# EasyEDA Pro project Magmattic PCB_V2.eprj, schematic BB-ADS1262-Rev.A
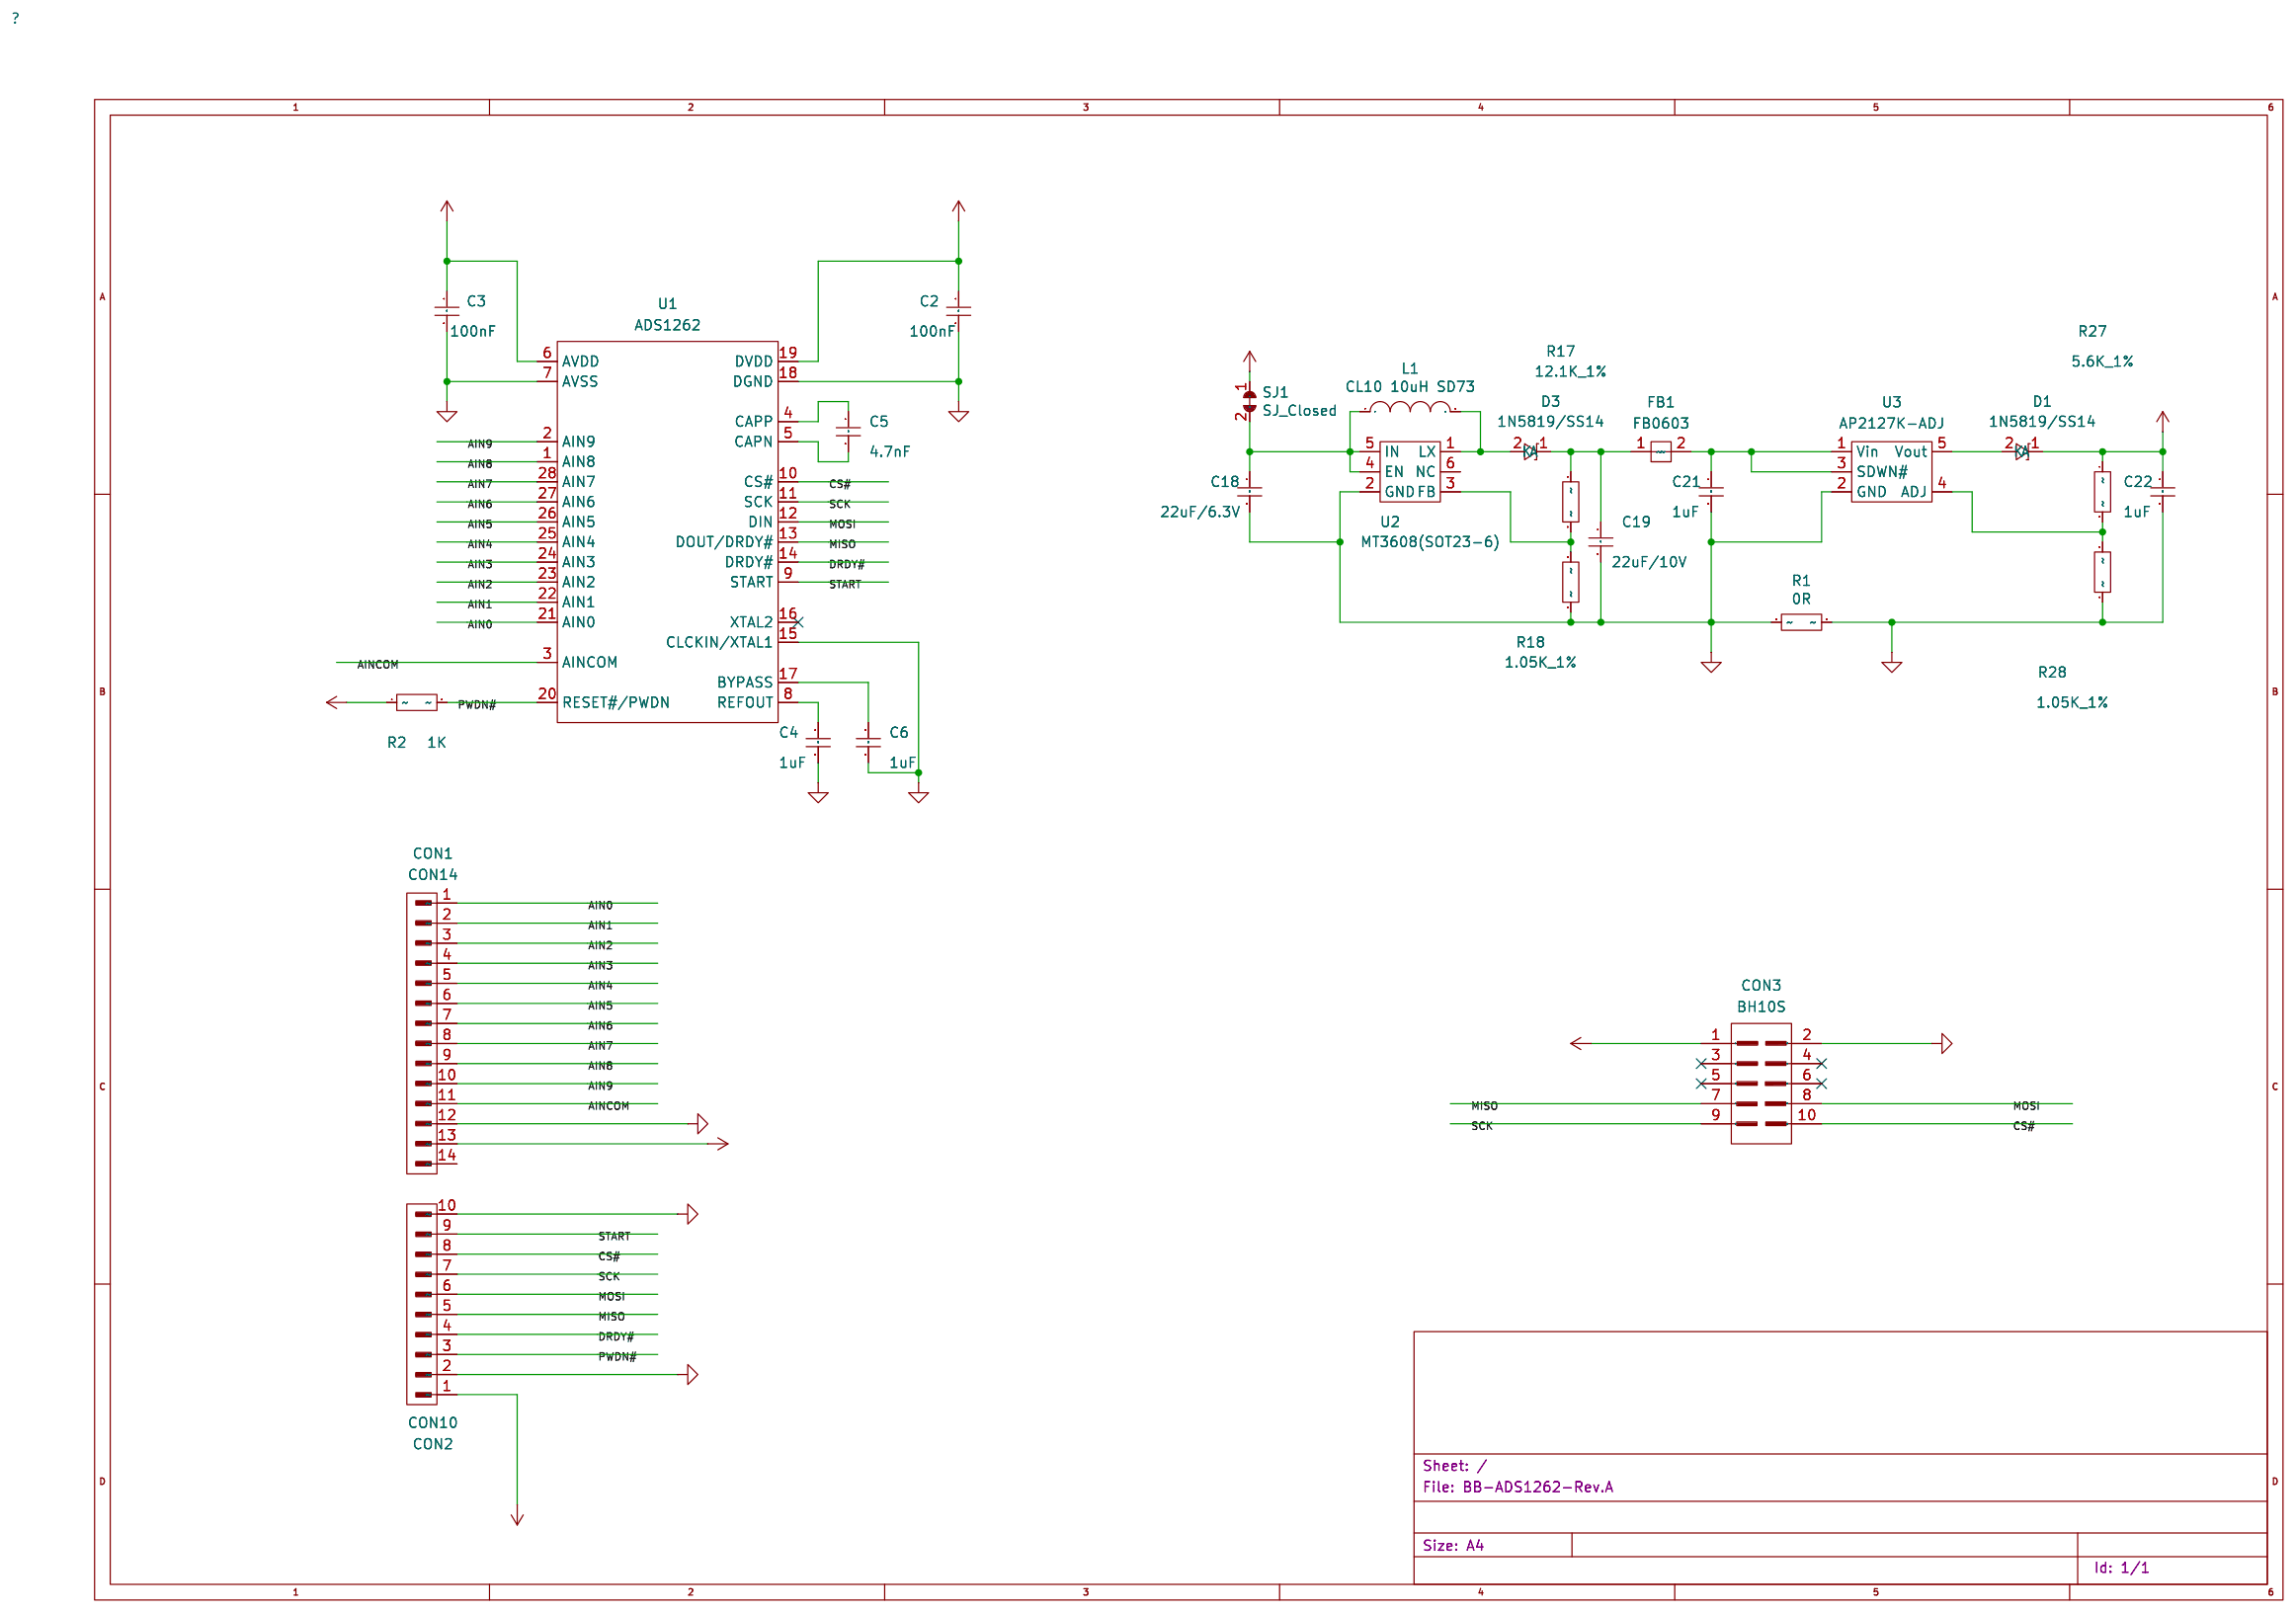
[diagram p1: schematic sheet]

## Parts
C2  100nF  [OLIMEX_RLC-FP:C_0603_5MIL_DWS]
C3  100nF  [OLIMEX_RLC-FP:C_0603_5MIL_DWS]
C4  1uF  [OLIMEX_RLC-FP:C_0603_5MIL_DWS]
C5  4.7nF  [OLIMEX_RLC-FP:C_0603_5MIL_DWS]
C6  1uF  [OLIMEX_RLC-FP:C_0603_5MIL_DWS]
C18  22uF/6.3V  [OLIMEX_RLC-FP:C_0603_5MIL_DWS]
C19  22uF/10V  [OLIMEX_RLC-FP:C_0603_5MIL_DWS]
C21  1uF  [OLIMEX_RLC-FP:C_0603_5MIL_DWS]
C22  1uF  [OLIMEX_RLC-FP:C_0603_5MIL_DWS]
CON1  CON14  [OLIMEX_Connectors-FP:HN1x13]
CON2  CON10  [OLIMEX_Connectors-FP:HN1x10]
CON3  BH10S  [OLIMEX_Connectors-FP:UEXTF]
D1  1N5819/SS14  [OLIMEX_Diodes-FP:SOD-123_KA]
D3  1N5819/SS14  [OLIMEX_Diodes-FP:SOD-123_KA]
FB1  FB0603  [OLIMEX_RLC-FP:L_0603_5MIL_DWS]
L1  CL10 10uH SD73  [OLIMEX_RLC-FP:SD73]
R1  0R  [OLIMEX_RLC-FP:R_0603_5MIL_0R(Board_Mounted)]
R2  1K  [OLIMEX_RLC-FP:R_0603_5MIL_DWS]
R17  12.1K_1%  [OLIMEX_RLC-FP:R_0603_5MIL_DWS]
R18  1.05K_1%  [OLIMEX_RLC-FP:R_0603_5MIL_DWS]
R27  5.6K_1%  [OLIMEX_RLC-FP:R_0603_5MIL_DWS]
R28  1.05K_1%  [OLIMEX_RLC-FP:R_0603_5MIL_DWS]
SJ1  SJ_Closed
U1  ADS1262  [OLIMEX_IC-FP:TSSOP28-PW]
U2  MT3608(SOT23-6)  [OLIMEX_Regulators-FP:SOT23-6]
U3  AP2127K-ADJ  [OLIMEX_Regulators-FP:SOT-23-5]

## Library data of the parts
C2-C6 C18 C19 C21 C22 = BB-ADS1262-Rev.A_C
CON1 = BB-ADS1262-Rev.A_CON14
CON2 = BB-ADS1262-Rev.A_CON10
CON3 = BB-ADS1262-Rev.A_BH10S
D1 D3 = BB-ADS1262-Rev.A_D_Schottky_Small
FB1 = BB-ADS1262-Rev.A_FB0805
L1 = BB-ADS1262-Rev.A_INDUCTOR_SMALL
R1 R2 R17 R18 R27 R28 = BB-ADS1262-Rev.A_R
SJ1 = BB-ADS1262-Rev.A_SJ_Closed
U1 = BB-ADS1262-Rev.A_ADS1262
U2 = BB-ADS1262-Rev.A_MT3608(SOT23-6)
U3 = BB-ADS1262-Rev.A_AP2127K-ADJ

## Nets
AIN0: CON1.1 U1.21(AIN0)
AIN1: CON1.2 U1.22(AIN1)
AIN2: CON1.3 U1.23(AIN2)
AIN3: CON1.4 U1.24(AIN3)
AIN4: CON1.5 U1.25(AIN4)
AIN5: CON1.6 U1.26(AIN5)
AIN6: CON1.7 U1.27(AIN6)
AIN7: CON1.8 U1.28(AIN7)
AIN8: CON1.9 U1.1(AIN8)
AIN9: CON1.10 U1.2(AIN9)
AINCOM: CON1.11 U1.3(AINCOM)
BB-ADS1262-REV.A_+3.3VD: C2.1 CON2.1 CON3.1 R2.1 SJ1.1 U1.19(DVDD)
BB-ADS1262-REV.A_+5VA: C3.1 C22.1 CON1.13 D1.1(K) R27.1 U1.6(AVDD)
BB-ADS1262-REV.A_GNDA: C3.2 C4.2 C22.2 CON1.12 R1.1 R28.2 U1.7(AVSS)
BB-ADS1262-REV.A_GNDD: C2.2 C6.2 C18.2 C19.2 C21.2 CON2.2 CON2.10 CON3.2 R1.2 R18.2 U1.15(CLCKIN/XTAL1) U1.18(DGND) U2.2(GND) U3.2(GND)
CS#: CON2.8 CON3.10 U1.10(CS#)
DRDY#: CON2.4 U1.14(DRDY#)
MISO: CON2.5 CON3.7 U1.13(DOUT/DRDY#)
MOSI: CON2.6 CON3.8 U1.12(DIN)
PWDN#: CON2.3 R2.2 U1.20(RESET#/PWDN)
SCK: CON2.7 CON3.9 U1.11(SCK)
START: CON2.9 U1.9(START)
NET-(C4-PAD1): C4.1 U1.8(REFOUT)
NET-(C5-PAD1): C5.1 U1.4(CAPP)
NET-(C5-PAD2): C5.2 U1.5(CAPN)
NET-(C6-PAD1): C6.1 U1.17(BYPASS)
NET-(C18-PAD1): C18.1 L1.1 SJ1.2 U2.4(EN) U2.5(IN)
NET-(C19-PAD1): C19.1 D3.1(K) FB1.1 R17.1
NET-(C21-PAD1): C21.1 FB1.2 U3.1(Vin) U3.3(SDWN#)
NET-(D1-PAD2): D1.2(A) U3.5(Vout)
NET-(D3-PAD2): D3.2(A) L1.2 U2.1(LX)
NET-(R17-PAD2): R17.2 R18.1 U2.3(FB)
NET-(R27-PAD2): R27.2 R28.1 U3.4(ADJ)

Not connected (* = marked no-connect by the designer): CON1 14; CON3 3* 4* 5* 6*; U1 16(XTAL2)*; U2 6(NC)
